# EasyEDA Pro project picobug.epro, schematic Schematic1
Board Name: Board1; Create Date: 2025-08-06; Page Name: P1; Project Name: Picobug; Schematic Name: Schematic1; Update Date: 2025-08-06; Company: Arca Cengiz; Page Size: A4; Version: V1.0
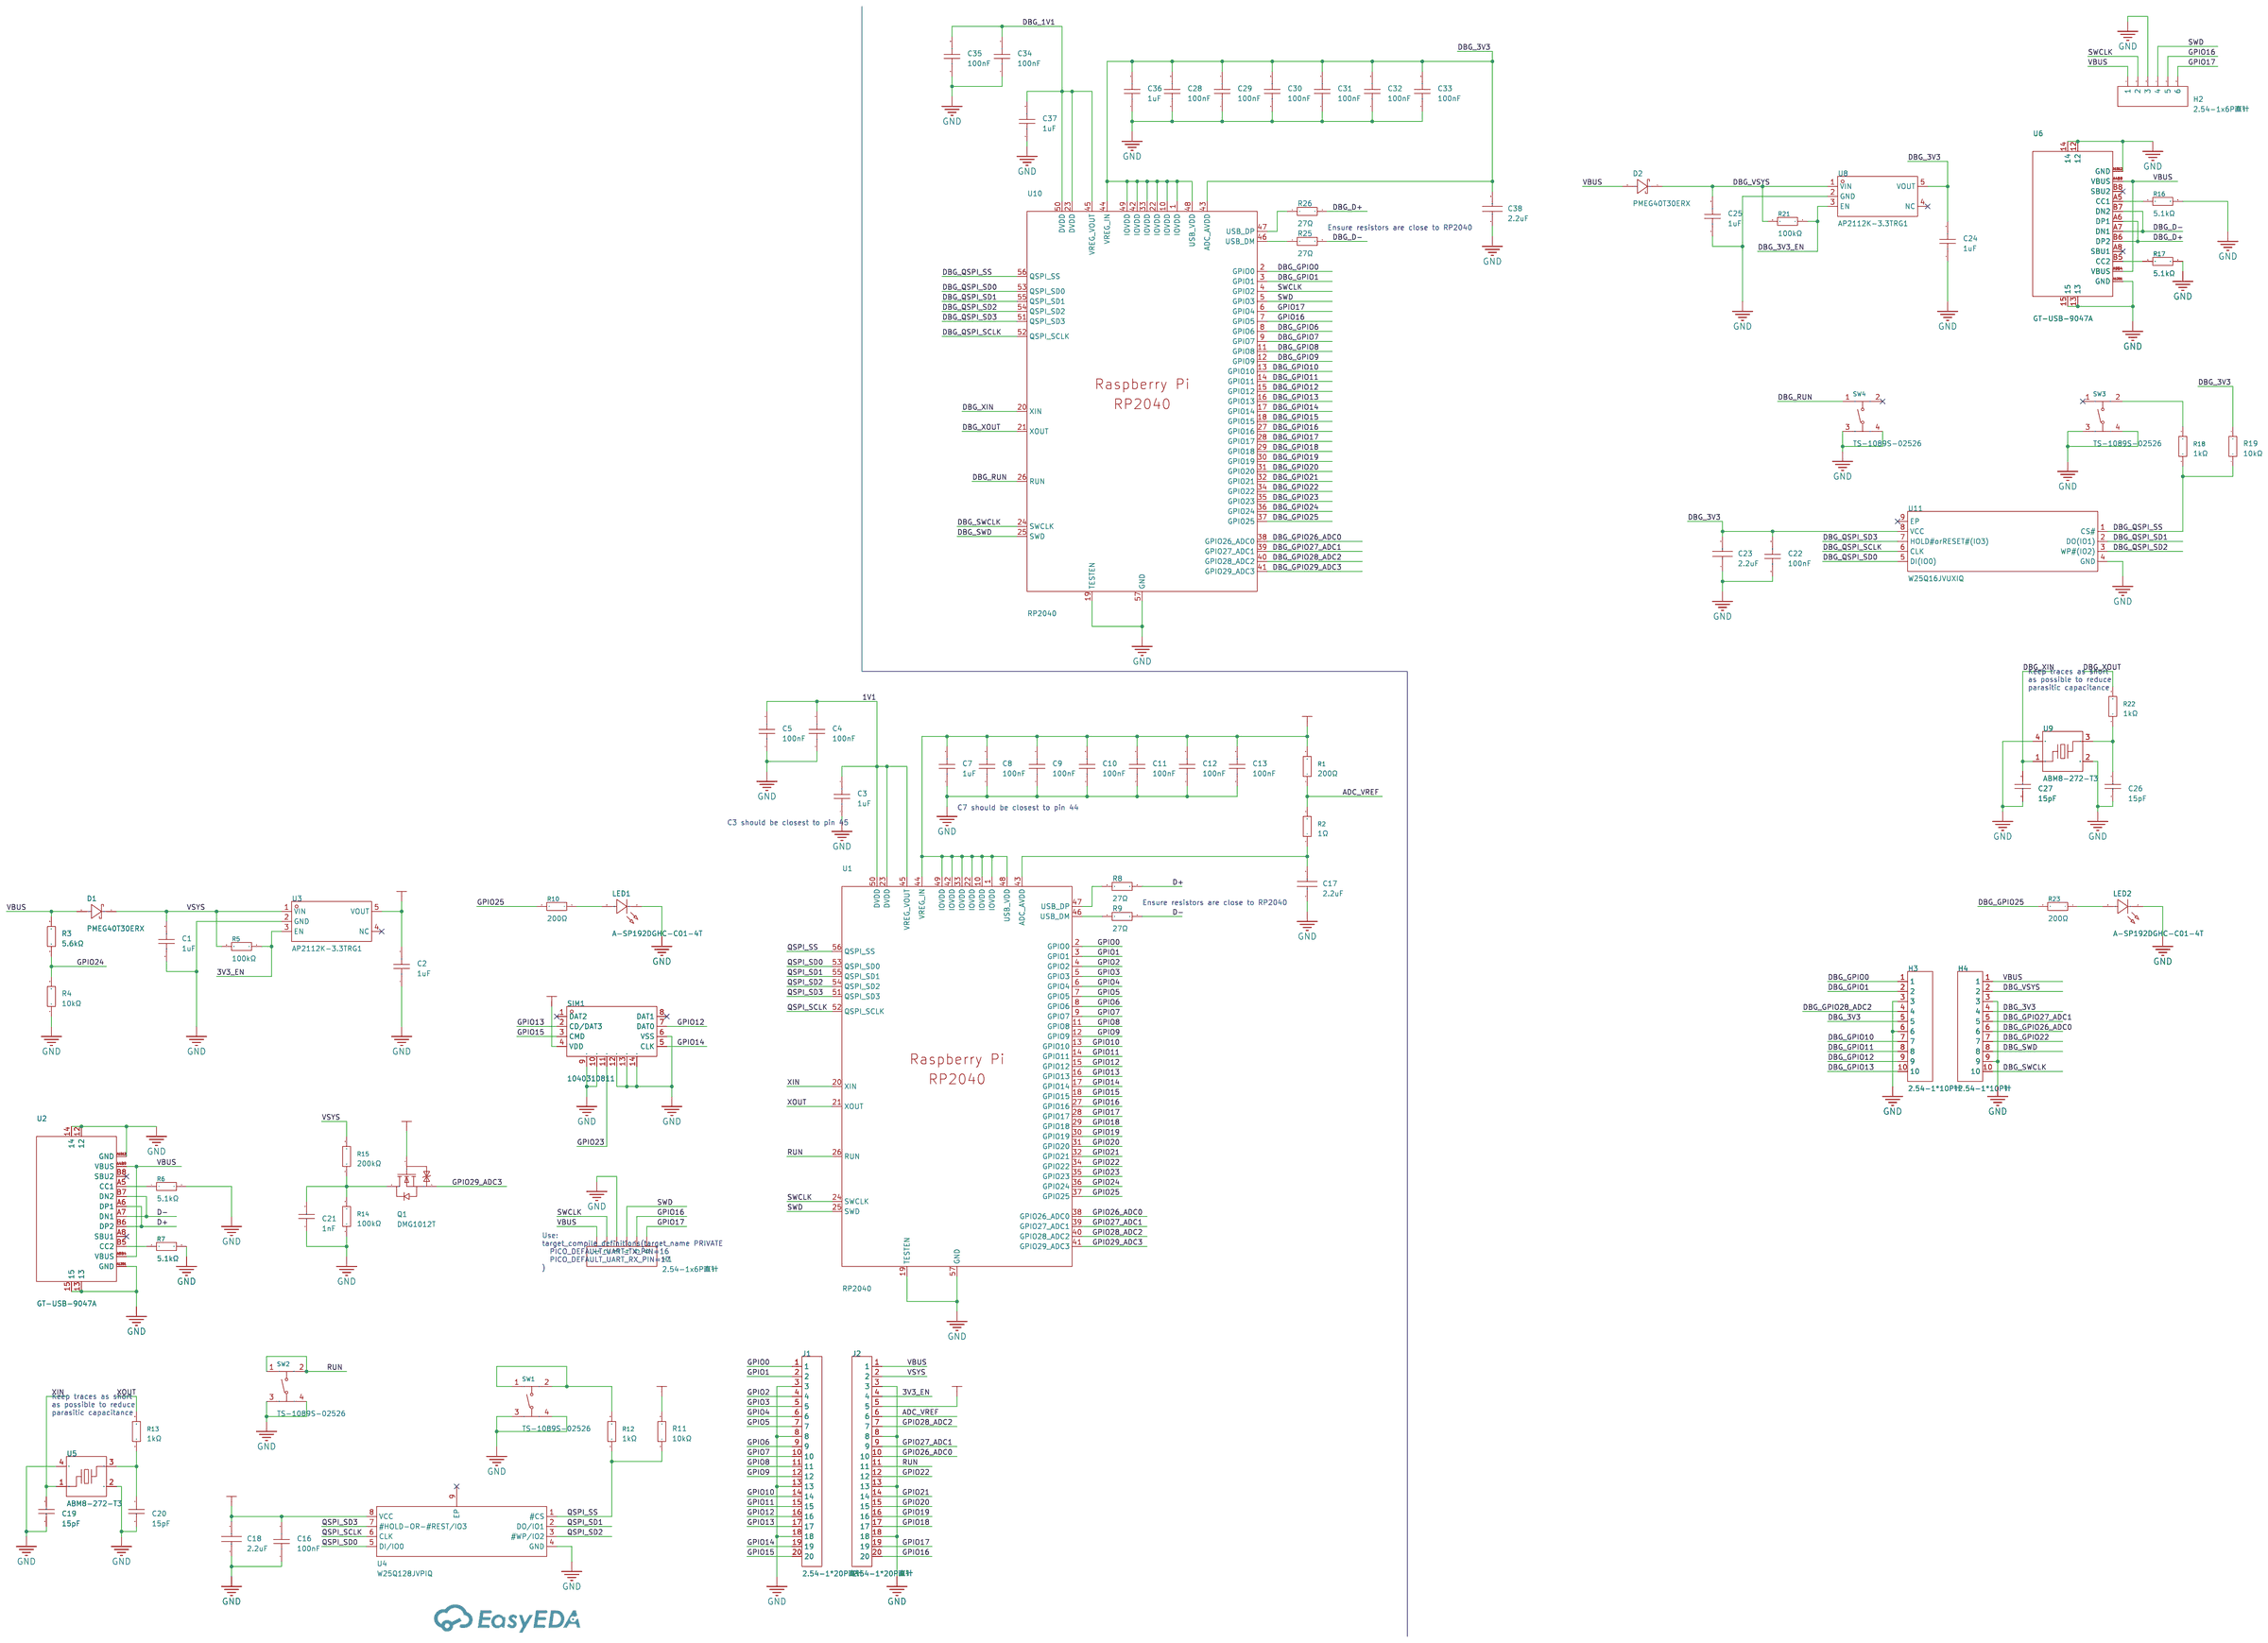
[diagram p0: schematic sheet]

## Parts
C1  1uF  [C0402]
C2  1uF  [C0402]
C3  1uF  [C0402]
C4  100nF  [C0402]
C5  100nF  [C0402]
C7  1uF  [C0402]
C8  100nF  [C0402]
C9  100nF  [C0402]
C10  100nF  [C0402]
C11  100nF  [C0402]
C12  100nF  [C0402]
C13  100nF  [C0402]
C16  100nF  [C0402]
C17  2.2uF  [C0402]
C18  2.2uF  [C0402]
C19  15pF  [C0402]
C20  15pF  [C0402]
C21  1nF  [C0402]
C22  100nF  [C0402]
C23  2.2uF  [C0402]
C24  1uF  [C0402]
C25  1uF  [C0402]
C26  15pF  [C0402]
C27  15pF  [C0402]
C28  100nF  [C0402]
C29  100nF  [C0402]
C30  100nF  [C0402]
C31  100nF  [C0402]
C32  100nF  [C0402]
C33  100nF  [C0402]
C34  100nF  [C0402]
C35  100nF  [C0402]
C36  1uF  [C0402]
C37  1uF  [C0402]
C38  2.2uF  [C0402]
D1  PMEG40T30ERX  [SOD-123W_L2.8-W1.8-LS3.7-RD]
D2  PMEG40T30ERX  [SOD-123W_L2.8-W1.8-LS3.7-RD]
H1  2.54-1x6P直针  [HDR-TH_6P-P2.54-V-M-1]
H2  2.54-1x6P直针  [HDR-TH_6P-P2.54-V-M-1]
H3  2.54-1*10P针  [HDR-TH_10P-P2.54-V-M-1]
H4  2.54-1*10P针  [HDR-TH_10P-P2.54-V-M-1]
J1  2.54-1*20P直针  [HDR-TH_20P-P2.54-V-M-1]
J2  2.54-1*20P直针  [HDR-TH_20P-P2.54-V-M-1]
LED1  A-SP192DGHC-C01-4T  [LED0603-FD]
LED2  A-SP192DGHC-C01-4T  [LED0603-FD]
Q1  DMG1012T  [SOT-523-3_L1.6-W0.8-P1.00-LS1.6-BR]
R1  200Ω  [R0402]
R2  1Ω  [R0603]
R3  5.6kΩ  [R0402]
R4  10kΩ  [R0402]
R5  100kΩ  [R0402]
R6  5.1kΩ  [R0402]
R7  5.1kΩ  [R0402]
R8  27Ω  [R0402]
R9  27Ω  [R0402]
R10  200Ω  [R0402]
R11  10kΩ  [R0402]
R12  1kΩ  [R0402]
R13  1kΩ  [R0402]
R14  100kΩ  [R0402]
R15  200kΩ  [R0402]
R16  5.1kΩ  [R0402]
R17  5.1kΩ  [R0402]
R18  1kΩ  [R0402]
R19  10kΩ  [R0402]
R21  100kΩ  [R0402]
R22  1kΩ  [R0402]
R23  200Ω  [R0402]
R25  27Ω  [R0402]
R26  27Ω  [R0402]
SIM1  1040310811  [SIM-SMD_8P-1040310811]
SW1  TS-1089S-02526  [SW-SMD_4P-L4.2-W3.3-P2.15-LS5.1]
SW2  TS-1089S-02526  [SW-SMD_4P-L4.2-W3.3-P2.15-LS5.1]
SW3  TS-1089S-02526  [SW-SMD_4P-L4.2-W3.3-P2.15-LS5.1]
SW4  TS-1089S-02526  [SW-SMD_4P-L4.2-W3.3-P2.15-LS5.1]
U1  RP2040  [LQFN-56_L7.0-W7.0-P0.4-EP]
U2  GT-USB-9047A  [USB-C-SMD_GT-USB-9047A]
U3  AP2112K-3.3TRG1  [SOT-25-5_L2.9-W1.6-P0.95-LS2.8-BL]
U4  W25Q128JVPIQ  [WSON-8_L6.0-W5.0-P1.27-BL-EP]
U5  ABM8-272-T3  [CRYSTAL-SMD_4P-L3.2-W2.5-BL]
U6  GT-USB-9047A  [USB-C-SMD_GT-USB-9047A]
U8  AP2112K-3.3TRG1  [SOT-25-5_L2.9-W1.6-P0.95-LS2.8-BL]
U9  ABM8-272-T3  [CRYSTAL-SMD_4P-L3.2-W2.5-BL]
U10  RP2040  [LQFN-56_L7.0-W7.0-P0.4-EP]
U11  W25Q16JVUXIQ  [USON-8_L3.0-W2.0-P0.50-BL-EP]

## Library data of the parts
C1-C3 C7 C24 C25 C36 C37 = CL05A105KA5NQNC: Capacitance: Tolerance:±10% Tolerance:±10% Voltage Rated: Temperature Coefficient:; LCSC Part Name: 1uF ±10% 25V; Supplier Part: C52923; Manufacturer: SAMSUNG(三星); Supplier Footprint: 0402; JLCPCB Part Class: Basic Part; Datasheet: https://atta.szlcsc.com/upload/public/pdf/source/20160218/1457707763339.pdf; Supplier: LCSC; Tolerance: ±10%
C4 C5 C8-C13 C16 C22 C28-C35 = CL05B104KO5NNNC: Capacitance: Tolerance:±10% Tolerance:±10% Voltage Rated: Temperature Coefficient:; LCSC Part Name: 100nF ±10% 16V; Supplier Part: C1525; Manufacturer: SAMSUNG(三星); Supplier Footprint: 0402; JLCPCB Part Class: Basic Part; Datasheet: https://atta.szlcsc.com/upload/public/pdf/source/20160218/1457707763339.pdf; Supplier: LCSC; Tolerance: ±10%
C17 C18 C23 C38 = CL05A225MQ5NSNC: Capacitance: Tolerance:±20% Tolerance:±20% Voltage Rated: Temperature Coefficient:; LCSC Part Name: 2.2uF ±20% 6.3V; Supplier Part: C12530; Manufacturer: SAMSUNG(三星); Supplier Footprint: 0402; JLCPCB Part Class: Basic Part; Datasheet: https://atta.szlcsc.com/upload/public/pdf/source/20160218/1457707763339.pdf; Supplier: LCSC; Tolerance: ±20%
C19 C20 C26 C27 = 0402CG150J500NT: Capacitance: Tolerance:±5% Tolerance:±5% Voltage Rated: Temperature Coefficient:; LCSC Part Name: 15pF ±5% 50V; Supplier Part: C1548; Manufacturer: FH(风华); Supplier Footprint: 0402; JLCPCB Part Class: Basic Part; Datasheet: https://atta.szlcsc.com/upload/public/pdf/source/20200305/C486355_26A10D38EF8C2A5C37091D0039909270.pdf; Supplier: LCSC; Tolerance: ±5%
C21 = 0402B102K500NT: Capacitance:1nF Tolerance:±10% Tolerance:±10% Voltage Rated: Temperature Coefficient:; LCSC Part Name: 1nF ±10% 50V; Supplier Part: C1523; Manufacturer: FH(风华); Supplier Footprint: 0402; JLCPCB Part Class: Basic Part; Datasheet: https://atta.szlcsc.com/upload/public/pdf/source/20200305/C486355_26A10D38EF8C2A5C37091D0039909270.pdf; Supplier: LCSC; Tolerance: ±10%
D1 D2 = PMEG40T30ERX: Forward Voltage (Vf@If):525mV@3A Reverse Voltage (Vr):40V Rectified Current:3A Reverse Leakage Current (Ir):28uA@40V; LCSC Part Name: 电压:40V 电流:3A; Supplier Part: C552920; Manufacturer: Nexperia(安世); Supplier Footprint: SOD-123W; JLCPCB Part Class: Extended Part; Datasheet: https://atta.szlcsc.com/upload/public/pdf/source/20200610/C552920_1C4F9B9D3AA5C67B7A3C6EB96D4042EE.pdf; Supplier: LCSC; Forward Voltage (Vf@If): 525mV@3A; Reverse Voltage (Vr): 40V; Rectified Current: 3A; Reverse Leakage Current (Ir): 28uA@40V
H1 H2 = 2.54-1x6P直针: Pin Structure:1x6P Pitch:2.54mm Row Spacing:- Circluar Pins/Square Pins:Policy Mounting Type:Straight Number of Rows:Single Row Number of Pins:6P Current Rating:3A Voltage Rating (Max):- Length of Mating Pin:- Insulation Height:- Contact Material:Brass Co; LCSC Part Name: 1x6P 间距:2.54mm 方针 直插; Supplier Part: C37208; Manufacturer: BOOMELE(博穆精密); Supplier Footprint: 插件,P=2.54mm; JLCPCB Part Class: Extended Part; Datasheet: https://atta.szlcsc.com/upload/public/pdf/source/20250115/42A019761A40C8B839643401D8CA5A96.pdf; Supplier: LCSC; Pin Structure: 1x6P; Pitch: 2.54mm; Circluar Pins/Square Pins: Policy; Mounting Type: Straight; Number of Rows: Single Row; Number of Pins: 6P; Current Rating: 3A; Contact Material: Brass; Operating Temperature: -40℃~+105℃; Color: Black
H3 H4 = 2.54-1*10P针: Pin Structure:1x10P Pitch:2.54mm Row Spacing:- Circluar Pins/Square Pins:Policy Mounting Type:Straight Number of Rows:Single Row Number of Pins:10P Current Rating:3A Voltage Rating (Max):- Length of Mating Pin:- Insulation Height:- Length of End Connectio; LCSC Part Name: 1x10P 间距:2.54mm 方针 直插; Supplier Part: C57369; Manufacturer: BOOMELE(博穆精密); Supplier Footprint: 插件,P=2.54mm; JLCPCB Part Class: Extended Part; Datasheet: https://atta.szlcsc.com/upload/public/pdf/source/20151109/1457707572883.pdf; Supplier: LCSC; Pin Structure: 1x10P; Pitch: 2.54mm; Circluar Pins/Square Pins: Policy; Mounting Type: Straight; Number of Rows: Single Row; Number of Pins: 10P; Current Rating: 3A; Operating Temperature: -40℃~+105℃; Color: Black
J1 J2 = 2.54-1*20P直针: Pin Structure:1x20P Pitch:2.54mm Row Spacing:- Circluar Pins/Square Pins:Policy Mounting Type:Straight Number of Rows:Single Row Number of Pins:20P Current Rating:3A Voltage Rating (Max):- Length of Mating Pin:- Insulation Height:- Length of End Connectio; LCSC Part Name: 1x20P 间距:2.54mm 方针 直插; Supplier Part: C50981; Manufacturer: BOOMELE(博穆精密); Supplier Footprint: 插件,P=2.54mm; JLCPCB Part Class: Extended Part; Datasheet: https://atta.szlcsc.com/upload/public/pdf/source/20151109/1457707572883.pdf; Supplier: LCSC; Pin Structure: 1x20P; Pitch: 2.54mm; Circluar Pins/Square Pins: Policy; Mounting Type: Straight; Number of Rows: Single Row; Number of Pins: 20P; Current Rating: 3A; Contact Material: Brass; Operating Temperature: -40℃~+105℃; Color: Black
LED1 LED2 = A-SP192DGHC-C01-4T: Emitted Color:Green Forward Voltage (VF):2.4V~3V Forward Voltage (VF):2.4V~3V Power Dissipation:70mW Dominant Wavelength:520nm~535nm Dominant Wavelength:520nm~535nm Lens Color:Colorless Transparent Lens Luminous Intensity:225mcd~450mcd Luminous Intensity:; LCSC Part Name: 0603高亮绿灯正贴; Supplier Part: C19171301; Manufacturer: Amicc(欧密格光电); Supplier Footprint: 0603; JLCPCB Part Class: Extended Part; Datasheet: https://atta.szlcsc.com/upload/public/pdf/source/20231108/CAA90604E374CB6B31BBE970B55159E7.pdf; Supplier: LCSC; Emitted Color: Green; Forward Voltage (VF): 2.4V~3V; Power Dissipation: 70mW; Dominant Wavelength: 520nm~535nm; Lens Color: Colorless Transparent Lens; Luminous Intensity: 225mcd~450mcd; Viewing Angle: 120°; Mounting Sytle: Positive Stick; Operating Temperature: -40℃~+85℃
Q1 = DMG1012T_C2830301: Type:1 N-channel Drain to Source Voltage:20V Current - Continuous Drain(Id):800mA RDS(on):250mΩ@4.5V Pd - Power Dissipation:280mW Gate Threshold Voltage (Vgs(th)@Id):750mV Gate Charge(Qg):- Input Capacitance(Ciss@Vds):120pF Reverse Transfer Capacitance (C; LCSC Part Name: 1个N沟道 耐压:20V 电流:800mA; Supplier Part: C2830301; Manufacturer: TECH PUBLIC(台舟); Supplier Footprint: SOT-523-3; JLCPCB Part Class: Extended Part; Datasheet: https://atta.szlcsc.com/upload/public/pdf/source/20210810/F66BEDC33783684E5512DC16AE08AF92.pdf; Supplier: LCSC; Type: 1 N-channel; Drain to Source Voltage: 20V; Current - Continuous Drain(Id): 800mA; RDS(on): 250mΩ@4.5V; Pd - Power Dissipation: 280mW; Gate Threshold Voltage (Vgs(th)@Id): 750mV; Input Capacitance(Ciss@Vds): 120pF; Reverse Transfer Capacitance (Crss@Vds): 15pF; Operating Temperature: -55℃~+150℃
R1 R10 R23 = 0402WGF2000TCE: Type:Thick Film Resistor Resistance:200Ω Tolerance:±1% Tolerance:±1% Power(Watts):62.5mW Voltage-Supply(Max):50V Temperature Coefficient:±100ppm/℃ Temperature Coefficient:±100ppm/℃ Operating Temperature:-55℃~+155℃ Operating Temperature:-55℃~+155℃; LCSC Part Name: 200Ω ±1% 62.5mW 厚膜电阻; Supplier Part: C25087; Manufacturer: UNI-ROYAL(厚声); Supplier Footprint: 0402; JLCPCB Part Class: Basic Part; Datasheet: https://atta.szlcsc.com/upload/public/pdf/source/20200306/C422600_1E6D84923E4A46A82E41ADD87F860B5C.pdf; Supplier: LCSC; Type: Thick Film Resistor; Tolerance: ±1%; Power(Watts): 62.5mW; Voltage-Supply(Max): 50V; Temperature Coefficient: ±100ppm/℃; Operating Temperature: -55℃~+155℃
R2 = 0603WAF100KT5E: Type:Thick Film Resistors Resistance:1Ω Tolerance:±1% Tolerance:±1% Power(Watts): Overload Voltage (Max): Temperature Coefficient:±400ppm/℃ Temperature Coefficient:±400ppm/℃ Operating Temperature Range:-55℃~+155℃ Operating Temperature Range:-55℃~+155℃; LCSC Part Name: 1Ω ±1% 100mW 厚膜电阻; Supplier Part: C22936; Manufacturer: UNI-ROYAL(厚声); Supplier Footprint: 0603; JLCPCB Part Class: Basic Part; Datasheet: https://atta.szlcsc.com/upload/public/pdf/source/20200306/C422600_1E6D84923E4A46A82E41ADD87F860B5C.pdf; Supplier: LCSC; Type: Thick Film Resistors; Tolerance: ±1%; Temperature Coefficient: ±400ppm/℃; Operating Temperature Range: -55℃~+155℃
R3 = 0402WGF5601TCE: Type:Thick Film Resistors Resistance:5.6kΩ Tolerance:±1% Tolerance:±1% Power(Watts): Overload Voltage (Max): Temperature Coefficient:±100ppm/℃ Temperature Coefficient:±100ppm/℃ Operating Temperature Range:-55℃~+155℃ Operating Temperature Range:-55℃~+155℃; LCSC Part Name: 5.6kΩ ±1% 62.5mW 厚膜电阻; Supplier Part: C25908; Manufacturer: UNI-ROYAL(厚声); Supplier Footprint: 0402; JLCPCB Part Class: Extended Part; Datasheet: https://atta.szlcsc.com/upload/public/pdf/source/20200306/C422600_1E6D84923E4A46A82E41ADD87F860B5C.pdf; Supplier: LCSC; Type: Thick Film Resistors; Tolerance: ±1%; Temperature Coefficient: ±100ppm/℃; Operating Temperature Range: -55℃~+155℃
R4 R11 R19 = 0402WGF1002TCE: Type:Thick Film Resistors Resistance:10kΩ Tolerance:±1% Tolerance:±1% Power(Watts): Overload Voltage (Max): Temperature Coefficient:±100ppm/℃ Temperature Coefficient:±100ppm/℃ Operating Temperature Range:-55℃~+155℃ Operating Temperature Range:-55℃~+155℃; LCSC Part Name: 10kΩ ±1% 62.5mW 厚膜电阻; Supplier Part: C25744; Manufacturer: UNI-ROYAL(厚声); Supplier Footprint: 0402; JLCPCB Part Class: Basic Part; Datasheet: https://atta.szlcsc.com/upload/public/pdf/source/20200306/C422600_1E6D84923E4A46A82E41ADD87F860B5C.pdf; Supplier: LCSC; Type: Thick Film Resistors; Tolerance: ±1%; Temperature Coefficient: ±100ppm/℃; Operating Temperature Range: -55℃~+155℃
R5 R14 R21 = 0402WGF1003TCE: Type:Thick Film Resistors Resistance:100kΩ Tolerance:±1% Tolerance:±1% Power(Watts): Overload Voltage (Max): Temperature Coefficient:±100ppm/℃ Temperature Coefficient:±100ppm/℃ Operating Temperature Range:-55℃~+155℃ Operating Temperature Range:-55℃~+155℃; LCSC Part Name: 100kΩ ±1% 62.5mW 厚膜电阻; Supplier Part: C25741; Manufacturer: UNI-ROYAL(厚声); Supplier Footprint: 0402; JLCPCB Part Class: Basic Part; Datasheet: https://atta.szlcsc.com/upload/public/pdf/source/20200306/C422600_1E6D84923E4A46A82E41ADD87F860B5C.pdf; Supplier: LCSC; Type: Thick Film Resistors; Tolerance: ±1%; Temperature Coefficient: ±100ppm/℃; Operating Temperature Range: -55℃~+155℃
R6 R7 R16 R17 = 0402WGF5101TCE: Type:Thick Film Resistor Resistance:5.1kΩ Tolerance:±1% Tolerance:±1% Power(Watts):62.5mW Voltage-Supply(Max):50V Temperature Coefficient:±100ppm/℃ Temperature Coefficient:±100ppm/℃ Operating Temperature:-55℃~+155℃ Operating Temperature:-55℃~+155℃; LCSC Part Name: 5.1kΩ ±1% 62.5mW 厚膜电阻; Supplier Part: C25905; Manufacturer: UNI-ROYAL(厚声); Supplier Footprint: 0402; JLCPCB Part Class: Basic Part; Datasheet: https://atta.szlcsc.com/upload/public/pdf/source/20200306/C422600_1E6D84923E4A46A82E41ADD87F860B5C.pdf; Supplier: LCSC; Type: Thick Film Resistor; Tolerance: ±1%; Power(Watts): 62.5mW; Voltage-Supply(Max): 50V; Temperature Coefficient: ±100ppm/℃; Operating Temperature: -55℃~+155℃
R8 R9 R25 R26 = RC0402FR-0727RL: Type:Thick Film Resistor Resistance:27Ω Tolerance:±1% Tolerance:±1% Power(Watts):62.5mW Voltage-Supply(Max):50V Temperature Coefficient:±100ppm/℃ Temperature Coefficient:±100ppm/℃ Operating Temperature:-55℃~+155℃ Operating Temperature:-55℃~+155℃; LCSC Part Name: 厚膜电阻 27Ω ±1% 62.5mW; Supplier Part: C138021; Manufacturer: YAGEO(国巨); Supplier Footprint: 0402; JLCPCB Part Class: Extended Part; Datasheet: https://atta.szlcsc.com/upload/public/pdf/source/20250610/89E4D743C004A82A45145C7A2CC3A578.pdf; Supplier: LCSC; Type: Thick Film Resistor; Tolerance: ±1%; Power(Watts): 62.5mW; Voltage-Supply(Max): 50V; Temperature Coefficient: ±100ppm/℃; Operating Temperature: -55℃~+155℃
R12 R13 R18 R22 = 0402WGF1001TCE: Type:Thick Film Resistors Resistance:1kΩ Tolerance:±1% Tolerance:±1% Power(Watts): Overload Voltage (Max): Temperature Coefficient:±100ppm/℃ Temperature Coefficient:±100ppm/℃ Operating Temperature Range:-55℃~+155℃ Operating Temperature Range:-55℃~+155℃; LCSC Part Name: 1kΩ ±1% 62.5mW 厚膜电阻; Supplier Part: C11702; Manufacturer: UNI-ROYAL(厚声); Supplier Footprint: 0402; JLCPCB Part Class: Basic Part; Datasheet: https://atta.szlcsc.com/upload/public/pdf/source/20200306/C422600_1E6D84923E4A46A82E41ADD87F860B5C.pdf; Supplier: LCSC; Type: Thick Film Resistors; Tolerance: ±1%; Temperature Coefficient: ±100ppm/℃; Operating Temperature Range: -55℃~+155℃
R15 = 0402WGF2003TCE: Type:Thick Film Resistors Resistance:200kΩ Tolerance:±1% Tolerance:±1% Power(Watts): Overload Voltage (Max): Temperature Coefficient:±100ppm/℃ Temperature Coefficient:±100ppm/℃ Operating Temperature Range:-55℃~+155℃ Operating Temperature Range:-55℃~+155℃; LCSC Part Name: 200kΩ ±1% 62.5mW 厚膜电阻; Supplier Part: C25764; Manufacturer: UNI-ROYAL(厚声); Supplier Footprint: 0402; JLCPCB Part Class: Basic Part; Datasheet: https://atta.szlcsc.com/upload/public/pdf/source/20200306/C422600_1E6D84923E4A46A82E41ADD87F860B5C.pdf; Supplier: LCSC; Type: Thick Film Resistors; Tolerance: ±1%; Temperature Coefficient: ±100ppm/℃; Operating Temperature Range: -55℃~+155℃
SIM1 = 1040310811: Card Connection Mode:Plug-in Card Type:MicroSD card (TF card) Connector Type:Card Slot Additional Card Detection Pins:- Supplementary Features:- Height Above Board:1.42mm Operating Temperature:-25℃~+85℃ Operating Temperature:-25℃~+85℃; LCSC Part Name: 拔插式 MicroSD卡(TF卡) 卡座; Supplier Part: C585350; Manufacturer: MOLEX; Supplier Footprint: SMD; JLCPCB Part Class: Extended Part; Datasheet: https://www.molex.com/content/dam/molex/molex-dot-com/products/automated/en-us/salesdrawingpdf/104/104031/1040310811_sd.pdf?inline; Supplier: LCSC; Card Connection Mode: Plug-in; Card Type: MicroSD card (TF card); Connector Type: Card Slot; Height Above Board: 1.42mm; Operating Temperature: -25℃~+85℃
SW1-SW4 = TS-1089S-02526: Circuit:SPST Actuator Style:Oval button Mounting Style:Brick nogging Switch Length:4.2mm Switch Width:3.25mm Switch Height:2.5mm Contact Current:50mA Voltage Rating (DC):12V With Lamp:- Mechanical Life:-; LCSC Part Name: 4.2*3.25*2.5mm 立贴 轻触开关; Supplier Part: C455282; Manufacturer: XUNPU(讯普); Supplier Footprint: SMD,3.3x4.2mm; JLCPCB Part Class: Extended Part; Datasheet: https://atta.szlcsc.com/upload/public/pdf/source/20191118/C455282_2E86A26A9CC4FEF4662951C4D45ED672.pdf; Supplier: LCSC; Circuit: SPST; Actuator Style: Oval button; Mounting Style: Brick nogging; Switch Length: 4.2mm; Switch Width: 3.25mm; Switch Height: 2.5mm; Contact Current: 50mA; Voltage Rating (DC): 12V
U1 U10 = RP2040_C2040: CPU Core:- CPU Maximum Speed:133MHz Number of I/O:30 ADC (Bit):12bit Applications:-; LCSC Part Name: RP2040（RP2B2）; Supplier Part: C2040; Manufacturer: Raspberry Pi(树莓派); Supplier Footprint: LQFN-56(7x7); JLCPCB Part Class: Extended Part; Datasheet: https://atta.szlcsc.com/upload/public/pdf/source/20210621/C2040_96F425825606B7957D87DD32E2512CA9.pdf; Supplier: LCSC; CPU Maximum Speed: 133MHz; Number of I/O: 30; ADC (Bit): 12bit
U2 U6 = GT-USB-9047A: Connector Type:Type-C Protocol Standard:USB 2.0 Gender:Female Mounting Type:Surface Mount, Right Angle Number of Contacts:16P Number of Ports:1 Current Rating-Power:5A Voltage Rating:24V Connect-Disconnect Life:10,000 Cycles Supplementary Features:- Cente; LCSC Part Name: Type-C 母 卧贴; Supplier Part: C5117882; Manufacturer: G-Switch(品赞); Supplier Footprint: SMD; JLCPCB Part Class: Extended Part; Datasheet: https://atta.szlcsc.com/upload/public/pdf/source/20250507/517974E04384C576B41392852D87A3D7.pdf; Supplier: LCSC; Connector Type: Type-C; Protocol Standard: USB 2.0; Gender: Female; Mounting Type: Surface Mount, Right Angle; Number of Contacts: 16P; Number of Ports: 1; Current Rating-Power: 5A; Voltage Rating: 24V; Connect-Disconnect Life: 10,000 Cycles; Center Height: 1.68mm; Length: 7.35mm; Detection color: Black; Operating Temperature: -40℃~+85℃
U3 U8 = AP2112K-3.3TRG1: Output Type:Fixed Voltage - Supply:6V Output Voltage:3.3V Output Voltage:3.3V Output Current:600mA Power Supply Rejection Ratio (PSRR):65dB@(1kHz) Voltage Dropout:250mV@(600mA) standby current:55uA Noise:50uVrms Features:Enable；Over Temperature Protection; LCSC Part Name: 输入6V 输出3.3V 600mA; Supplier Part: C51118; Manufacturer: DIODES(美台); Supplier Footprint: SOT-25-5; JLCPCB Part Class: Extended Part; Datasheet: https://atta.szlcsc.com/upload/public/pdf/source/20171221/C51118_15138312998391195590.pdf; Supplier: LCSC; Output Type: Fixed; Voltage - Supply: 6V; Output Voltage: 3.3V; Output Current: 600mA; Power Supply Rejection Ratio (PSRR): 65dB@(1kHz); Voltage Dropout: 250mV@(600mA); standby current: 55uA; Noise: 50uVrms; Features: Enable；Over Temperature Protection；Over Current Protection; Operating Temperature: -40℃~+85℃@(Ta); Output Configuration: Positive; Number of Outputs: 1
U4 = W25Q128JVPIQ: Interface:SPI Memory Size:- Clock Frequency:133MHz Voltage - Supply:2.7V~3.6V Voltage - Supply:2.7V~3.6V Program / Erase Cycles:100,000 Cycles Page Programming Time (Tpp):- Block Erase Time(tBE):120ms@(32KB) Data Retention - TDR (Year):20 Years Operating; Supplier Part: C190862; Manufacturer: Winbond(华邦); Supplier Footprint: WSON-8-EP(5x6); JLCPCB Part Class: Extended Part; Datasheet: https://atta.szlcsc.com/upload/public/pdf/source/20190705/C401662_06B6D416F67ED315879B366F63A3F7C9.pdf; Supplier: LCSC; Interface: SPI; Clock Frequency: 133MHz; Voltage - Supply: 2.7V~3.6V; Program / Erase Cycles: 100,000 Cycles; Block Erase Time(tBE): 120ms@(32KB); Data Retention - TDR (Year): 20 Years
U5 U9 = ABM8-272-T3_C20625731: Supplier Part: C20625731; Manufacturer: ABRACON; Supplier Footprint: SMD3225-4P; JLCPCB Part Class: Extended Part; Datasheet: https://atta.szlcsc.com/upload/public/pdf/source/20240227/A8BE43F636D80F75C9AF5C59EDF21E9A.pdf; Supplier: LCSC
U11 = W25Q16JVUXIQ: Interface:SPI Memory Size:16Mbit Clock Frequency:133MHz Voltage - Supply:2.7V~3.6V Voltage - Supply:2.7V~3.6V Program / Erase Cycles:100,000 Cycles Page Programming Time (Tpp):3ms Data Retention - TDR (Year):20 Years; Supplier Part: C2843335; Manufacturer: Winbond(华邦); Supplier Footprint: USON-8-EP(2x3); JLCPCB Part Class: Extended Part; Datasheet: https://atta.szlcsc.com/upload/public/pdf/source/20210629/C2843335_FB4D78B5076715625DC0C83F790D3044.pdf; Supplier: LCSC; Interface: SPI; Memory Size: 16Mbit; Clock Frequency: 133MHz; Voltage - Supply: 2.7V~3.6V; Program / Erase Cycles: 100,000 Cycles; Page Programming Time (Tpp): 3ms; Data Retention - TDR (Year): 20 Years

## Nets
1V1: C3.2 C4.2 C5.2 U1.23(DVDD) U1.45(VREG_VOUT) U1.50(DVDD)
3V3: C2.2 C7.2 C8.2 C9.2 C10.2 C11.2 C12.2 C13.2 C16.2 C18.2 J2.5 Q1.1(G) R1.2 R11.2 SIM1.4(VDD) U1.1(IOVDD) U1.10(IOVDD) U1.22(IOVDD) U1.33(IOVDD) U1.42(IOVDD) U1.44(VREG_IN) U1.48(USB_VDD) U1.49(IOVDD) U3.5(VOUT) U4.8(VCC)
3V3_EN: J2.4 R5.1 U3.3(EN)
GND: C1.1 C2.1 C3.1 C4.1 C5.1 C7.1 C8.1 C9.1 C10.1 C11.1 C12.1 C13.1 C16.1 C17.1 C18.1 C19.1 C20.1 C21.1 C22.1 C23.1 C24.1 C25.1 C26.1 C27.1 C28.1 C29.1 C30.1 C31.1 C32.1 C33.1 C34.1 C35.1 C36.1 C37.1 C38.1 H1.3 H2.3 H3.3 H3.6 H4.3 H4.9 J1.3 J1.8 J1.13 J1.18 J2.3 J2.8 J2.13 J2.18 LED1.1(K) LED2.1(K) R4.1 R6.2 R7.2 R14.1 R16.2 R17.2 SIM1.6(VSS) SIM1.9 SIM1.10 SIM1.12 SIM1.13 SIM1.14 SW1.3 SW1.4 SW2.3 SW2.4 SW3.3 SW3.4 SW4.3 SW4.4 U1.19(TESTEN) U1.57(GND) U2.12 U2.13 U2.14 U2.15 U2.A1B12(GND) U2.A12B1(GND) U3.2(GND) U4.4(GND) U5.2(GND) U5.4(GND) U6.12 U6.13 U6.14 U6.15 U6.A1B12(GND) U6.A12B1(GND) U8.2(GND) U9.2(GND) U9.4(GND) U10.19(TESTEN) U10.57(GND) U11.4(GND)
VBUS: D1.2(A) D2.2(A) H1.1 H2.1 H4.1 J2.1 R3.2 U2.A4B9(VBUS) U2.A9B4(VBUS) U6.A4B9(VBUS) U6.A9B4(VBUS)
ADC_VREF: J2.6 R1.1 R2.2
D+: R8.2 U2.A6(DP1) U2.B6(DP2)
D-: R9.2 U2.A7(DN1) U2.B7(DN2)
DBG_1V1: C34.2 C35.2 C37.2 U10.23(DVDD) U10.45(VREG_VOUT) U10.50(DVDD)
DBG_3V3: C22.2 C23.2 C24.2 C28.2 C29.2 C30.2 C31.2 C32.2 C33.2 C36.2 C38.2 H3.5 H4.4 R19.2 U8.5(VOUT) U10.1(IOVDD) U10.10(IOVDD) U10.22(IOVDD) U10.33(IOVDD) U10.42(IOVDD) U10.43(ADC_AVDD) U10.44(VREG_IN) U10.48(USB_VDD) U10.49(IOVDD) U11.8(VCC)
DBG_3V3_EN: R21.1 U8.3(EN)
DBG_D+: R26.2 U6.A6(DP1) U6.B6(DP2)
DBG_D-: R25.2 U6.A7(DN1) U6.B7(DN2)
DBG_GPIO0: H3.1 U10.2(GPIO0)
DBG_GPIO1: H3.2 U10.3(GPIO1)
DBG_GPIO6: U10.8(GPIO6)
DBG_GPIO7: U10.9(GPIO7)
DBG_GPIO8: U10.11(GPIO8)
DBG_GPIO9: U10.12(GPIO9)
DBG_GPIO10: H3.7 U10.13(GPIO10)
DBG_GPIO11: H3.8 U10.14(GPIO11)
DBG_GPIO12: H3.9 U10.15(GPIO12)
DBG_GPIO13: H3.10 U10.16(GPIO13)
DBG_GPIO14: U10.17(GPIO14)
DBG_GPIO15: U10.18(GPIO15)
DBG_GPIO16: U10.27(GPIO16)
DBG_GPIO17: U10.28(GPIO17)
DBG_GPIO18: U10.29(GPIO18)
DBG_GPIO19: U10.30(GPIO19)
DBG_GPIO20: U10.31(GPIO20)
DBG_GPIO21: U10.32(GPIO21)
DBG_GPIO22: H4.7 U10.34(GPIO22)
DBG_GPIO23: U10.35(GPIO23)
DBG_GPIO24: U10.36(GPIO24)
DBG_GPIO25: R23.2 U10.37(GPIO25)
DBG_GPIO26_ADC0: H4.6 U10.38(GPIO26_ADC0)
DBG_GPIO27_ADC1: H4.5 U10.39(GPIO27_ADC1)
DBG_GPIO28_ADC2: H3.4 U10.40(GPIO28_ADC2)
DBG_GPIO29_ADC3: U10.41(GPIO29_ADC3)
DBG_QSPI_SCLK: U10.52(QSPI_SCLK) U11.6(CLK)
DBG_QSPI_SD0: U10.53(QSPI_SD0) U11.5(DI(IO0))
DBG_QSPI_SD1: U10.55(QSPI_SD1) U11.2(DO(IO1))
DBG_QSPI_SD2: U10.54(QSPI_SD2) U11.3(WP#(IO2))
DBG_QSPI_SD3: U10.51(QSPI_SD3) U11.7(HOLD#orRESET#(IO3))
DBG_QSPI_SS: R18.1 R19.1 U10.56(QSPI_SS) U11.1(CS#)
DBG_RUN: SW4.1 U10.26(RUN)
DBG_SWCLK: H4.10 U10.24(SWCLK)
DBG_SWD: H4.8 U10.25(SWD)
DBG_VSYS: C25.2 D2.1(K) H4.2 R21.2 U8.1(VIN)
DBG_XIN: C27.2 U9.1 U10.20(XIN)
DBG_XOUT: R22.2 U10.21(XOUT)
GPIO0: J1.1 U1.2(GPIO0)
GPIO1: J1.2 U1.3(GPIO1)
GPIO2: J1.4 U1.4(GPIO2)
GPIO3: J1.5 U1.5(GPIO3)
GPIO4: J1.6 U1.6(GPIO4)
GPIO5: J1.7 U1.7(GPIO5)
GPIO6: J1.9 U1.8(GPIO6)
GPIO7: J1.10 U1.9(GPIO7)
GPIO8: J1.11 U1.11(GPIO8)
GPIO9: J1.12 U1.12(GPIO9)
GPIO10: J1.14 U1.13(GPIO10)
GPIO11: J1.15 U1.14(GPIO11)
GPIO12: J1.16 SIM1.7(DAT0) U1.15(GPIO12)
GPIO13: J1.17 SIM1.2(CD/DAT3) U1.16(GPIO13)
GPIO14: J1.19 SIM1.5(CLK) U1.17(GPIO14)
GPIO15: J1.20 SIM1.3(CMD) U1.18(GPIO15)
GPIO16: H1.5 H2.5 J2.20 U1.27(GPIO16) U10.7(GPIO5)
GPIO17: H1.6 H2.6 J2.19 U1.28(GPIO17) U10.6(GPIO4)
GPIO18: J2.17 U1.29(GPIO18)
GPIO19: J2.16 U1.30(GPIO19)
GPIO20: J2.15 U1.31(GPIO20)
GPIO21: J2.14 U1.32(GPIO21)
GPIO22: J2.12 U1.34(GPIO22)
GPIO23: SIM1.11 U1.35(GPIO23)
GPIO24: R3.1 R4.2 U1.36(GPIO24)
GPIO25: R10.2 U1.37(GPIO25)
GPIO26_ADC0: J2.10 U1.38(GPIO26_ADC0)
GPIO27_ADC1: J2.9 U1.39(GPIO27_ADC1)
GPIO28_ADC2: J2.7 U1.40(GPIO28_ADC2)
GPIO29_ADC3: Q1.2(S) U1.41(GPIO29_ADC3)
QSPI_SCLK: U1.52(QSPI_SCLK) U4.6(CLK)
QSPI_SD0: U1.53(QSPI_SD0) U4.5(DI/IO0)
QSPI_SD1: U1.55(QSPI_SD1) U4.2(DO/IO1)
QSPI_SD2: U1.54(QSPI_SD2) U4.3(#WP/IO2)
QSPI_SD3: U1.51(QSPI_SD3) U4.7(#HOLD-OR-#REST/IO3)
QSPI_SS: R11.1 R12.1 U1.56(QSPI_SS) U4.1(#CS)
RUN: J2.11 SW2.1 SW2.2 U1.26(RUN)
SWCLK: H1.2 H2.2 U1.24(SWCLK) U10.4(GPIO2)
SWD: H1.4 H2.4 U1.25(SWD) U10.5(GPIO3)
VSYS: C1.2 D1.1(K) J2.2 R5.2 R15.2 U3.1(VIN)
XIN: C19.2 U1.20(XIN) U5.1
XOUT: R13.2 U1.21(XOUT)
$1N3759: R7.1 U2.B5(CC2)
$1N3763: R6.1 U2.A5(CC1)
$1N4537: R8.1 U1.47(USB_DP)
$1N4543: R9.1 U1.46(USB_DM)
$1N4909: C17.2 R2.1 U1.43(ADC_AVDD)
$1N6487: LED1.2(A) R10.1
$1N8537: R12.2 SW1.1 SW1.2
$1N9518: C20.2 R13.1 U5.3
$1N10213: C21.2 Q1.3(D) R14.2 R15.1
$1N19566: R17.1 U6.B5(CC2)
$1N19567: R16.1 U6.A5(CC1)
$1N22078: C26.2 R22.1 U9.3
$1N22172: LED2.2(A) R23.1
$1N22974: R26.1 U10.47(USB_DP)
$1N22975: R25.1 U10.46(USB_DM)
$1N26122: R18.2 SW3.2

Not connected (* = marked no-connect by the designer): SIM1 1(DAT2)* 8(DAT1)*; SW3 1*; SW4 2*; U2 A8(SBU1)* B8(SBU2)*; U3 4(NC)*; U4 9(EP)*; U6 A8(SBU1)* B8(SBU2)*; U8 4(NC)*; U11 9(EP)*

## Notes on the sheet
- Ensure resistors are close to RP2040
- Keep traces as short
  as possible to reduce
  parasitic capacitance
- C7 should be closest to pin 44
- C3 should be closest to pin 45
- Ensure resistors are close to RP2040
- Use:
  target_compile_definitions(target_name PRIVATE
    PICO_DEFAULT_UART_TX_PIN=16
    PICO_DEFAULT_UART_RX_PIN=17
  )
- Keep traces as short
  as possible to reduce
  parasitic capacitance
